# EAGLE design mini_shirasu (EAGLE 9.7.0)
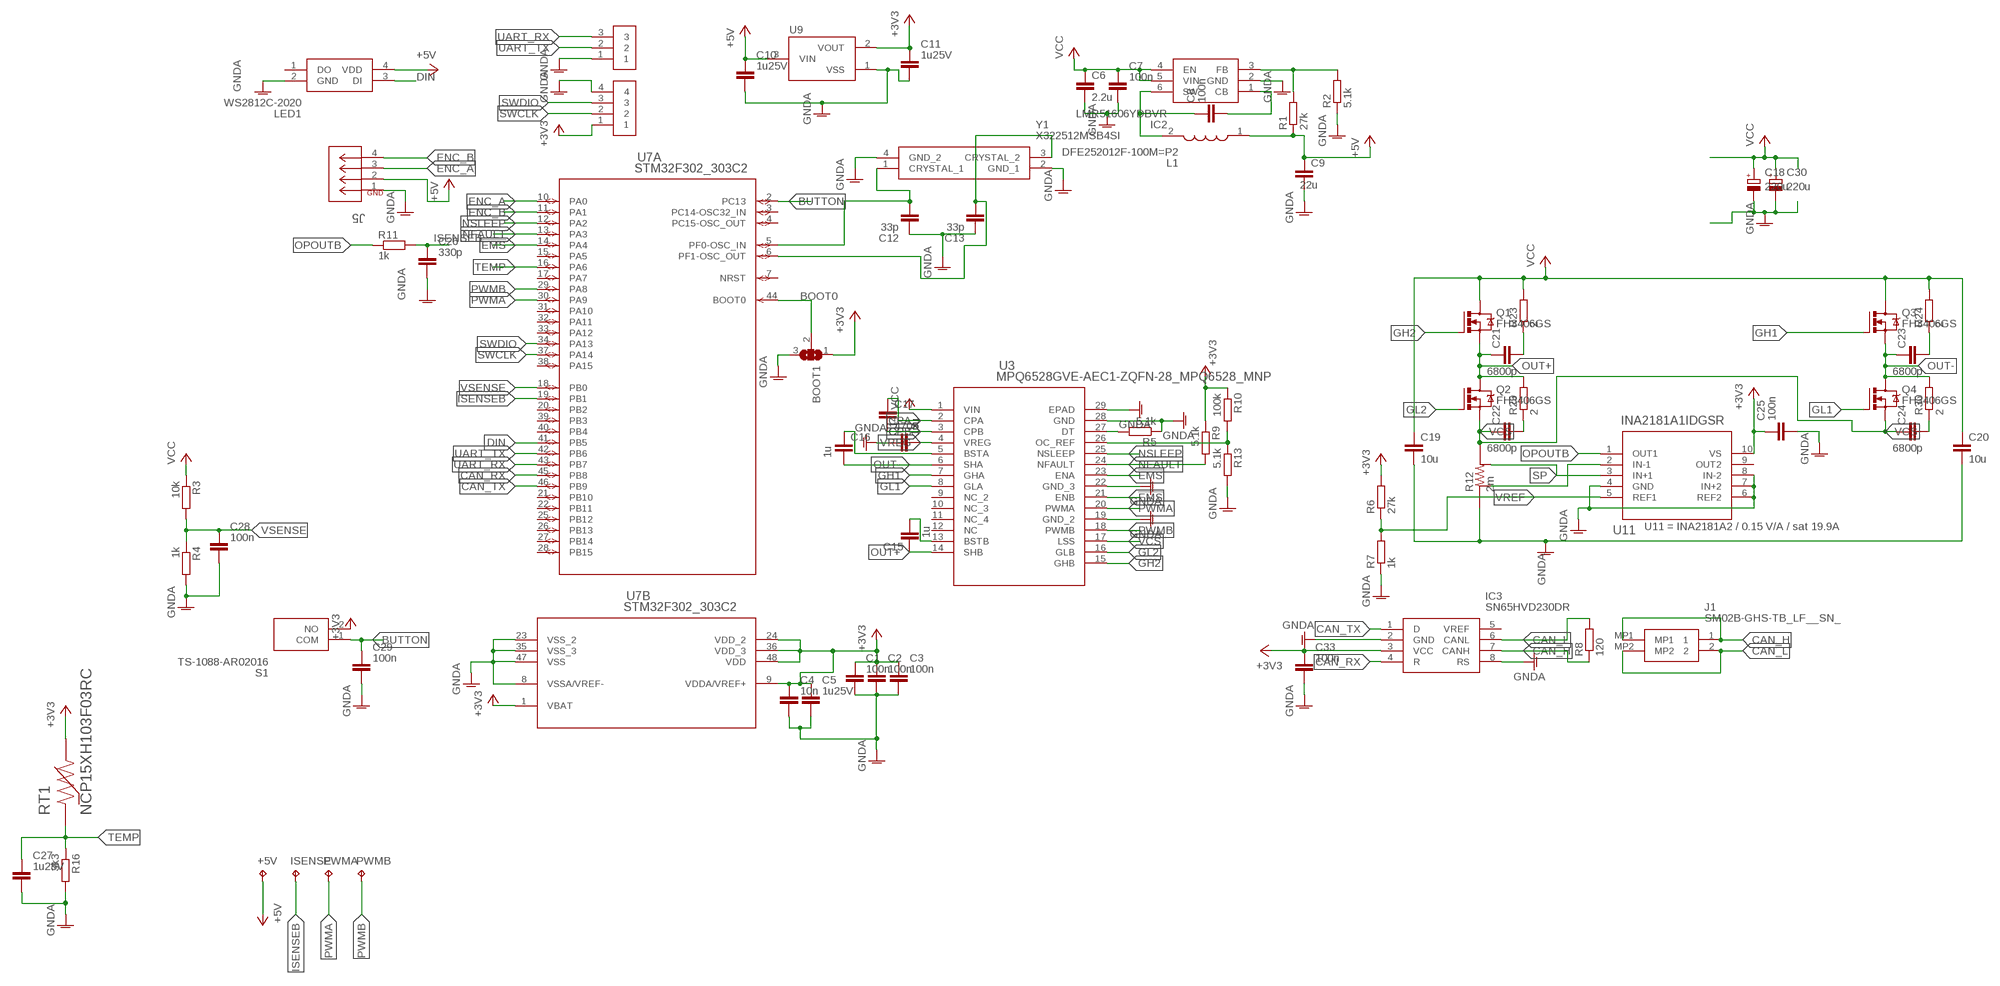
[diagram p0: schematic, sheet 1, part 1 of 2]
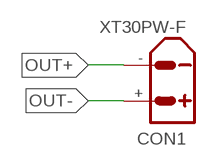
[diagram p1: schematic, sheet 1, part 2 of 2]

## Parts
+5V  TPB1,27  [B1,27]
BOOT1  SJ2W  [SJ_2]
C1  100n  C_CHIP-0402(1005-METRIC)  [CAPC1005X60]
C2  100n  C_CHIP-0402(1005-METRIC)  [CAPC1005X60]
C3  100n  C_CHIP-0402(1005-METRIC)  [CAPC1005X60]
C4  10n  C_CHIP-0402(1005-METRIC)  [CAPC1005X60]
C5  1u25V  C_CHIP-0402(1005-METRIC)  [CAPC1005X60]
C6  2.2u  C-EUC0805  [C0805]
C7  100n  C_CHIP-0402(1005-METRIC)  [CAPC1005X60]
C8  100n  C_CHIP-0402(1005-METRIC)  [CAPC1005X60]
C9  22u  C-EUC0805  [C0805]
C10  1u25V  C_CHIP-0402(1005-METRIC)  [CAPC1005X60]
C11  1u25V  C_CHIP-0402(1005-METRIC)  [CAPC1005X60]
C12  33p  C_CHIP-0402(1005-METRIC)  [CAPC1005X60]
C13  33p  C_CHIP-0402(1005-METRIC)  [CAPC1005X60]
C14  10u  C-EUC0805  [C0805]
C15  1u  C-EUC0603  [C0603]
C16  1u  C-EUC0603  [C0603]
C17  470n  C-EUC0805  [C0805]
C18  220u  C-POL_ECAP-10.5MM  [CAPAE1030X1050N]
C19  10u  C-EUC0805  [C0805]
C20  10u  C-EUC0805  [C0805]
C21  6800p  C-EUC0603  [C0603]
C22  6800p  C-EUC0603  [C0603]
C23  6800p  C-EUC0603  [C0603]
C24  6800p  C-EUC0603  [C0603]
C25  100n  C_CHIP-0402(1005-METRIC)  [CAPC1005X60]
C26  330p  C_CHIP-0402(1005-METRIC)  [CAPC1005X60]
C27  1u25V  C_CHIP-0402(1005-METRIC)  [CAPC1005X60]
C28  100n  C_CHIP-0402(1005-METRIC)  [CAPC1005X60]
C29  100n  C_CHIP-0402(1005-METRIC)  [CAPC1005X60]
C30  220u  C-POL_ECAP-10.5MM  [CAPAE1030X1050N]
C33  100n  C_CHIP-0402(1005-METRIC)  [CAPC1005X60]
CON1  XT30PW-F  [XT30PW-F]
IC2  LMR51606YDBVR  [SOT95P280X145-6N]
IC3  SN65HVD230DR  [SOT127P600X175-8N]
ISENSE  TPB1,27  [B1,27]
J1  SM02B-GHS-TB_LF__SN_  [SM02BGHSTBLFSN]
J5  EP2.5-4-SIDE  [CONN4_1744426-4]
L1  DFE252012F-100M=P2  [DFE2HCAH1R0MJ0L]
LED1  WS2812C-2020  [WS2812C2020]
PWMA  TPB1,27  [B1,27]
PWMB  TPB1,27  [B1,27]
Q1  FH3406GS  [DFN-8-5X6-FH3406GS]
Q2  FH3406GS  [DFN-8-5X6-FH3406GS]
Q3  FH3406GS  [DFN-8-5X6-FH3406GS]
Q4  FH3406GS  [DFN-8-5X6-FH3406GS]
R1  27k  R-EU_R0402  [R0402]
R2  5.1k  R-EU_R0402  [R0402]
R3  10k  R-EU_R0402  [R0402]
R4  1k  R-EU_R0402  [R0402]
R5  5.1k  R-EU_R0402  [R0402]
R6  27k  R-EU_R0402  [R0402]
R7  1k  R-EU_R0402  [R0402]
R8  120  R-EU_R0603  [R0603]
R9  5.1k  R-EU_R0402  [R0402]
R10  100k  R-EU_R0402  [R0402]
R11  1k  R-EU_R0402  [R0402]
R12  2m  R2512  [2512-4PAD]
R13  5.1k  R-EU_R0402  [R0402]
R16  3k3  R-EU_R0402  [R0402]
R23  2  R-EU_R0603  [R0603]
R24  2  R-EU_R0603  [R0603]
R29  2  R-EU_R0603  [R0603]
R30  2  R-EU_R0603  [R0603]
RT1  NCP15XH103F03RC  [THRMC1005X55N]
S1  TS-1088-AR02016  [TS1088AR02016]
U3  MPQ6528GVE-AEC1-ZQFN-28_MPQ6528_MNP  [QFN-28_MPQ6528_MNP]
U7  STM32F302_303C2  [LQFP48-7X7MM]
U9  XC6206  [SOT95P240X110-3]
U11  INA2181A1IDGSR  [DGS10]
U$1  PIN_HEADERPIN_HEADER  [PIN_HEADER]
U$2  3PIN_HEADER  [3PIN_HEADER]
Y1  X322512MSB4SI  [X322512MSB4SI]

## Nets
!EMS: U3.21(ENB) U3.23(ENA) U7.14(A:PA4)
+3V3: BOOT1.1 C1.1 C2.1 C3.1 C4.1 C5.1 C11.1 C25.1 C33.1 IC3.3(VCC) R6.2 R9.1 R10.1 RT1.2 S1.2(NO) U7.1(B:VBAT) U7.9(B:VDDA/VREF+) U7.24(B:VDD_2) U7.36(B:VDD_3) U7.48(B:VDD) U9.2(VOUT) U11.10(VS) U$1.1
+5V: +5V.TP C9.1 C10.1 J5.2 L1.1 LED1.4(VDD) R1.1 U9.3(VIN)
BOOT0: BOOT1.2 U7.44(A:BOOT0)
BST1: C16.1 U3.5(BSTA)
BST2: C15.2 U3.13(BSTB)
BUTTON: C29.1 S1.1(COM) U7.2(A:PC13)
CAN_H: IC3.7(CANH) J1.1 J1.MP1 R8.1
CAN_L: IC3.6(CANL) J1.2 J1.MP2 R8.2
CAN_RX: IC3.4(R) U7.45(A:PB8)
CAN_TX: IC3.1(D) U7.46(A:PB9)
CB: C8.2 IC2.1(CB)
CPA: C17.1 U3.2(CPA)
CPB: C17.2 U3.3(CPB)
DIN: LED1.3(DI) U7.41(A:PB5)
DT: R5.2 U3.27(DT)
ENC_A: J5.3 U7.10(A:PA0)
ENC_B: J5.4 U7.11(A:PA1)
FB: IC2.3(FB) R1.2 R2.2
GH1 [gate]: Q3.4(G) U3.7(GHA)
GH2 [gate]: Q1.4(G) U3.15(GHB)
GL1 [gate]: Q4.4(G) U3.8(GLA)
GL2 [gate]: Q2.4(G) U3.16(GLB)
GNDA: BOOT1.3 C1.2 C2.2 C3.2 C4.2 C5.2 C6.2 C7.2 C9.2 C10.2 C11.2 C12.1 C13.1 C14.1 C18.2(-) C19.2 C20.2 C25.2 C26.2 C27.2 C28.2 C29.2 C30.2(-) C33.2 IC2.2(GND) IC3.2(GND) IC3.8(RS) J5.1 LED1.2(GND) R2.1 R4.2 R5.1 R7.1 R12.1 R12.2 R13.2 R16.2 U3.19(GND_2) U3.22(GND_3) U3.28(GND) U3.29(EPAD) U7.8(B:VSSA/VREF-) U7.23(B:VSS_2) U7.35(B:VSS_3) U7.47(B:VSS) U9.1(VSS) U11.4(GND) U11.6(REF2) U11.7(IN+2) U11.8(IN-2) U$1.4 U$2.1 Y1.2(GND_1) Y1.4(GND_2)
ISENSEB: C26.1 ISENSE.TP R11.2 U7.19(A:PB1)
N$2: C12.2 U7.5(A:PF0-OSC_IN) Y1.1(CRYSTAL_1)
N$3: C13.2 U7.6(A:PF1-OSC_OUT) Y1.3(CRYSTAL_2)
N$12: C22.2 R29.1
N$13: C24.2 R30.1
N$31: R12.5 U11.2(IN-1)
N$38: C23.2 R24.1
N$39: C21.2 R23.1
NFAULT: R9.2 U3.24(NFAULT) U7.13(A:PA3)
NSLEEP: U3.25(NSLEEP) U7.12(A:PA2)
OC_REF: R10.2 R13.1 U3.26(OC_REF)
OPOUTB: R11.1 U11.1(OUT1)
OUT+: C15.1 C21.1 CON1.- Q1.1(S) Q1.2(S) Q1.3(S) Q2.5(D) Q2.6(D) Q2.7(D) Q2.8(D) Q2.9(D) R29.2 U3.14(SHB)
OUT-: C16.2 C23.1 CON1.+ Q3.1(S) Q3.2(S) Q3.3(S) Q4.5(D) Q4.6(D) Q4.7(D) Q4.8(D) Q4.9(D) R30.2 U3.6(SHA)
PWMA: PWMA.TP U3.20(PWMA) U7.30(A:PA9)
PWMB: PWMB.TP U3.18(PWMB) U7.29(A:PA8)
SP: R12.6 U11.3(IN+1)
SW: C8.1 IC2.6(SW) L1.2
SWCLK: U7.37(A:PA14) U$1.2
SWDIO: U7.34(A:PA13) U$1.3
TEMP: C27.1 R16.1 RT1.1 U7.16(A:PA6)
UART_RX: U7.43(A:PB7) U$2.3
UART_TX: U7.42(A:PB6) U$2.2
VCC: C6.1 C7.1 C18.1(+) C19.1 C20.1 C30.1(+) IC2.4(EN) IC2.5(VIN) Q1.5(D) Q1.6(D) Q1.7(D) Q1.8(D) Q1.9(D) Q3.5(D) Q3.6(D) Q3.7(D) Q3.8(D) Q3.9(D) R3.1 R23.2 R24.2 U3.1(VIN)
VCS: C22.1 C24.1 Q2.1(S) Q2.2(S) Q2.3(S) Q4.1(S) Q4.2(S) Q4.3(S) R12.3 R12.4 U3.17(LSS)
VREF: R6.1 R7.2 U11.5(REF1)
VREG: C14.2 U3.4(VREG)
VSENSE: C28.1 R3.2 R4.1 U7.18(A:PB0)
Unconnected: IC3.5(VREF) LED1.1(DO) U3.9(NC_2) U3.10(NC_3) U3.11(NC_4) U3.12(NC) U7.3(A:PC14-OSC32_IN) U7.4(A:PC15-OSC_OUT) U7.7(A:NRST) U7.15(A:PA5) U7.17(A:PA7) U7.20(A:PB2) U7.21(A:PB10) U7.22(A:PB11) U7.25(A:PB12) U7.26(A:PB13) U7.27(A:PB14) U7.28(A:PB15) U7.31(A:PA10) U7.32(A:PA11) U7.33(A:PA12) U7.38(A:PA15) U7.39(A:PB3) U7.40(A:PB4) U11.9(OUT2)

## Notes on the sheet
- U11 = INA2181A2 / 0.15 V/A / sat 19.9A

## Library data of the parts
+5V ISENSE PWMA PWMB = testpad:TP: Test pad
BOOT1 = jumper:SJ2W: SMD solder JUMPER
C1-C5 C7 C8 C10-C13 C25-C29 C33 = Capacitor:C: Capacitor - Generic; CATEGORY: Capacitor; PACKAGE_SIZE: 0402; PACKAGE_TYPE: SMD; SUBCATEGORY: Ceramic Capacitors; TYPE: MLCC
C6 C9 C14-C17 C19-C24 = rcl:C-EU: CAPACITOR, European symbol; SPICEPREFIX: C
C18 C30 = Capacitor:C-POL: Capacitor Polarised - Generic; CATEGORY: Capacitor; PACKAGE_SIZE: 10.5MM; PACKAGE_TYPE: SMD; SUBCATEGORY: Aluminum Electrolytic Capacitors; TYPE: Radial Can
CON1 = amass:XT30: AMASS XT30 connector Store in Japan AMASS XT30 connector <https://szc.jp/ams-xt30>
IC2 = LMR51606YDBVR:LMR51606YDBVR: Buck Switching Regulator IC Positive Adjustable 0.8V 1 Output 600mA SOT-23-6 Source: Datasheet <https://www.ti.com/lit/ds/symlink/lmr51606.pdf?ts=1713788939340&ref_url=https%3A%2F%2Feu.mouser.com%2F>; ARROW_PART_NUMBER: LMR51606YDBVR; ARROW_PRICE-STOCK: https://www.arrow.com/en/products/lmr51606ydbvr/texas-instruments.html?utm_currency=USD&region=nac; DESCRIPTION: Buck Switching Regulator IC Positive Adjustable 0.8V 1 Output 600mA SOT-23-6; HEIGHT: 1.45mm; MANUFACTURER_NAME: Texas Instruments; MANUFACTURER_PART_NUMBER: LMR51606YDBVR; MOUSER_PART_NUMBER: 595-LMR51606YDBVR; MOUSER_PRICE-STOCK: https://www.mouser.co.uk/ProductDetail/Texas-Instruments/LMR51606YDBVR?qs=mELouGlnn3dthntO7hU%252BdA%3D%3D
IC3 = SN65HVD230DR:SN65HVD230DR: 3.3 V CAN Transceiver with Standby Mode Source: Datasheet <http://www.ti.com/lit/gpn/sn65hvd230>; ARROW_PART_NUMBER: SN65HVD230DR; ARROW_PRICE-STOCK: https://www.arrow.com/en/products/sn65hvd230dr/texas-instruments.html?utm_currency=USD&region=nac; DESCRIPTION: 3.3 V CAN Transceiver with Standby Mode; HEIGHT: 1.75mm; MANUFACTURER_NAME: Texas Instruments; MANUFACTURER_PART_NUMBER: SN65HVD230DR; MOUSER_PART_NUMBER: 595-SN65HVD230DR; MOUSER_PRICE-STOCK: https://www.mouser.co.uk/ProductDetail/Texas-Instruments/SN65HVD230DR?qs=QViXGNcIEAtifeQR3pYVUQ%3D%3D
J1 = SM02B-GHS-TB_v2:SM02B-GHS-TB_LF__SN_: JST GH 2-pin side-entry SMT connector. Datasheet: https://www.jst-mfg.com/product/pdf/eng/eGH.pdf; HEIGHT: 4.25mm; MANUFACTURER: JST; MPN: SM02B-GHS-TB(LF)(SN)
J5 = con-ep2.5:EP2.5-4-SIDE; MANUFACTURER_PART_NUMBER: 17444264; VENDOR: TE Connectivity
L1 = DFE252012F-100M=P2:DFE252012F-100M=P2: DFE252012F Series Inductor 10uH +/-20% 1008 (2520) Source: Datasheet <https://search.murata.co.jp/Ceramy/image/img/P02/J(E)TE243A-0017.pdf>; ARROW_PART_NUMBER: DFE252012F-100M=P2; ARROW_PRICE-STOCK: https://www.arrow.com/en/products/dfe252012f-100mp2/murata-manufacturing.html?utm_currency=USD&region=nac; DESCRIPTION: DFE252012F Series Inductor 10uH +/-20% 1008 (2520); HEIGHT: 1.2mm; MANUFACTURER_NAME: Murata Electronics; MANUFACTURER_PART_NUMBER: DFE252012F-100M=P2; MOUSER_PART_NUMBER: 81-DFE252012F-100MP2; MOUSER_PRICE-STOCK: https://www.mouser.co.uk/ProductDetail/Murata-Electronics/DFE252012F-100M%3dP2?qs=ty6qhqyUUEuRek9wjqhclw%3D%3D
LED1 = WS2812C-2020:WS2812C-2020: Intelligent control LED integrated light source Source: Datasheet <http://www.world-semi.com/DownLoadFile/139>; DESCRIPTION: Intelligent control LED integrated light source; HEIGHT: 0.84mm; MANUFACTURER_NAME: Worldsemi; MANUFACTURER_PART_NUMBER: WS2812C-2020
Q1-Q4 = FH3406GS_PDFN5x6_8L:FH3406GS
R1-R11 R13 R16 R23 R24 R29 R30 = rcl:R-EU_: RESISTOR, European symbol; SPICEPREFIX: R
R12 = shunt-resistor:R2512
RT1 = NCP15XH103F03RC:NCP15XH103F03RC: NTC Thermistor 10k 0402 (1005 Metric) Check prices <https://pricing.snapeda.com/parts/NCP15XH103F03RC/Murata/view-part?ref=eda>; AVAILABILITY: Good; DESCRIPTION: NTC Thermistor 10k 0402 (1005 Metric); MF: Murata; MP: NCP15XH103F03RC; PACKAGE: 1005 Taiyo Yuden; PRICE: None; PURCHASE-URL: https://pricing.snapeda.com/search/part/NCP15XH103F03RC/?ref=eda
S1 = TS-1088-AR02016:TS-1088-AR02016: Tact Switch Source: Datasheet <https://www.xunpudianzi.com/uploads/pdf/TS-1088-ARXXX.pdf>; DESCRIPTION: Tact Switch; HEIGHT: 2mm; MANUFACTURER_NAME: XUNPU; MANUFACTURER_PART_NUMBER: TS-1088-AR02016
U3 = MPQ6528GVE-AEC1-Z:MPQ6528GVE-AEC1-Z; COPYRIGHT: Copyright (C) 2026 Ultra Librarian. All rights reserved.; DATASHEET: https://www.monolithicpower.com/en/documentview/productdocument/index/version/2/document_type/Datasheet/lang/en/sku/MPQ6528GVE-AEC1; DESCRIPTION: 5V to 60V H-Bridge Gate Driver AEC-Q100 Qualified; MANUFACTURER_NAME: Monolithic Power Systems; MANUFACTURER_PART_NUMBER: MPQ6528GVE-AEC1-Z
U7 = stm32_mcu:STM32F302_303C2; COPYRIGHT: Copyright (C) 2016 Accelerated Designs. All rights reserved; MANUFACTURER_PART_NUMBER: STM32F302_303C2; VENDOR: STMicroelectronics
U9 = torex:XC6206
U11 = texas-instruments:INA2181A1IDGSR; BUILT_BY: EMA_Jessica; COPYRIGHT: Copyright (C) 2018 Accelerated Designs. All rights reserved; MANUFACTURER_PART_NUMBER: INA2181A2IDGSR; VENDOR: Texas Instruments
U$1 = CRS_EAGLE_Lib:PIN_HEADER
U$2 = CRS_EAGLE_Lib:3PIN_HEADER
Y1 = X322512MSB4SI:X322512MSB4SI: SMD Crystal Resonators 12MHz +/-10ppm SMD-3225_4P RoHS Source: Datasheet <https://datasheet.lcsc.com/szlcsc/Yangxing-Tech-X322512MSB4SI_C9002.pdf>; DESCRIPTION: SMD Crystal Resonators 12MHz +/-10ppm SMD-3225_4P RoHS; HEIGHT: 0.8mm; MANUFACTURER_NAME: Yangxing Tech; MANUFACTURER_PART_NUMBER: X322512MSB4SI

## Board
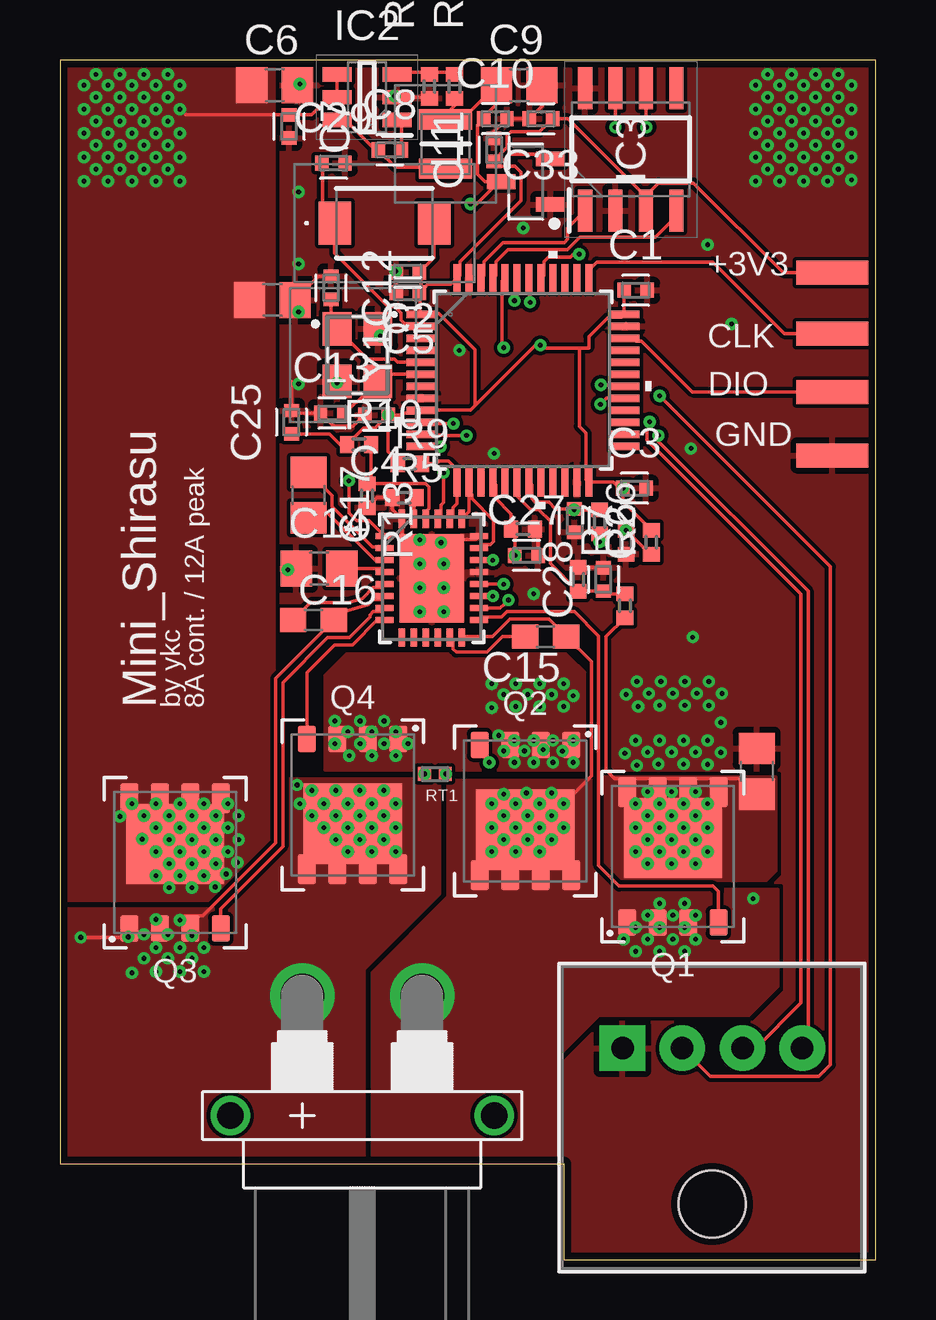
[diagram p2: board, top side]
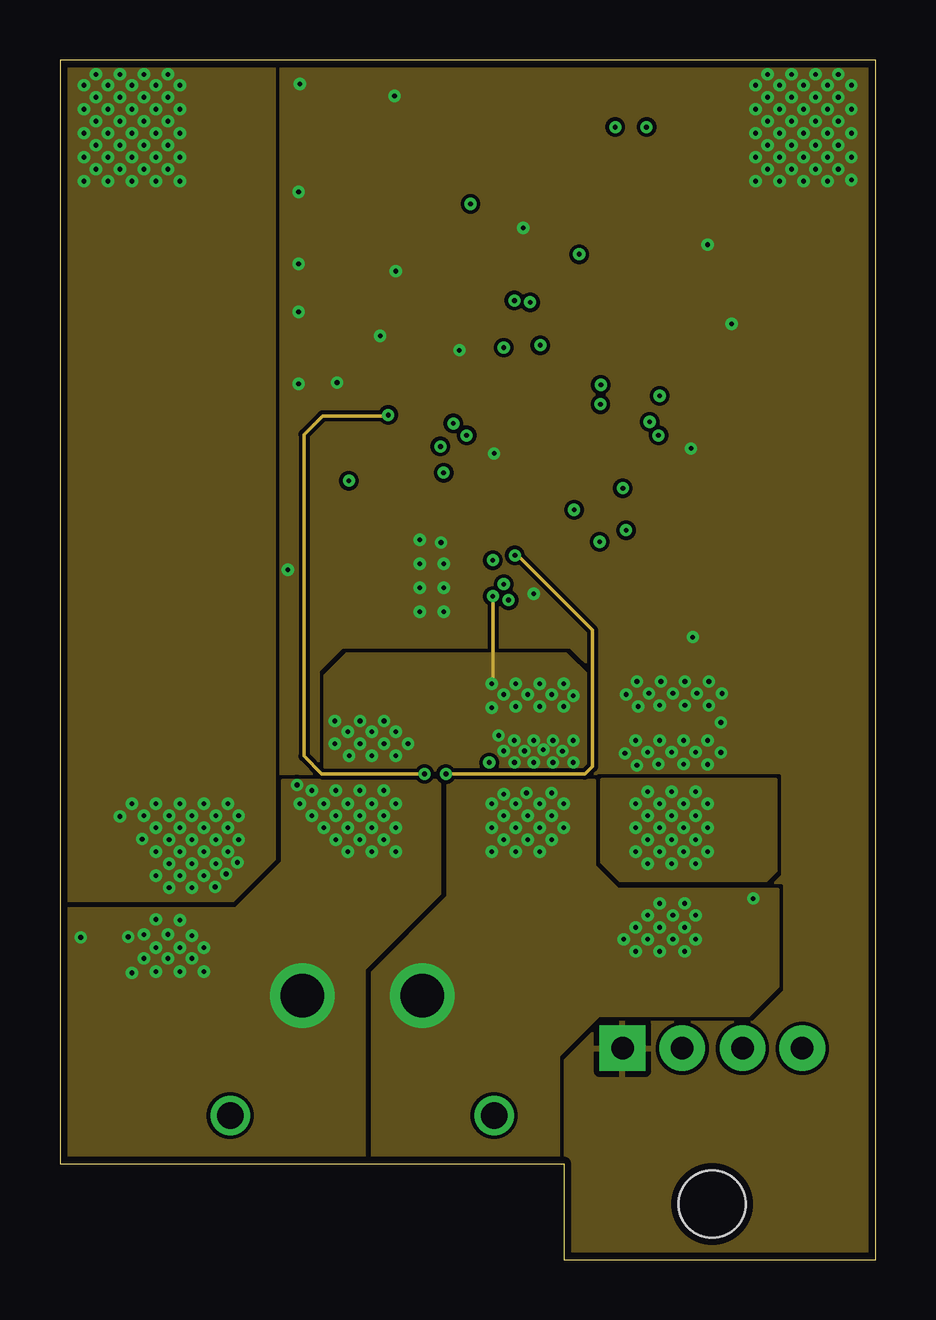
[diagram p3: board, inner layer Route2]
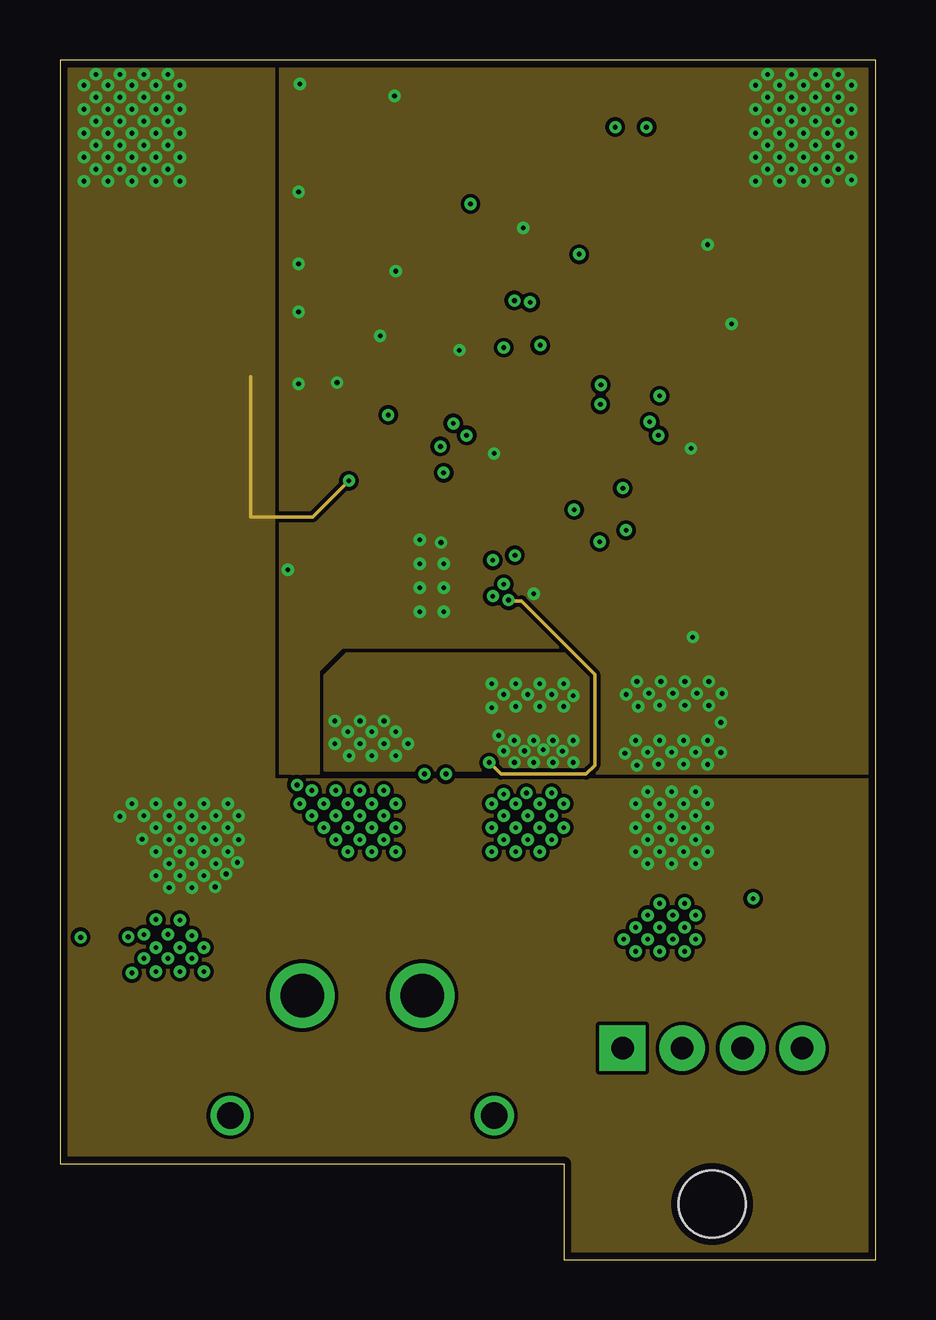
[diagram p4: board, inner layer Route15]
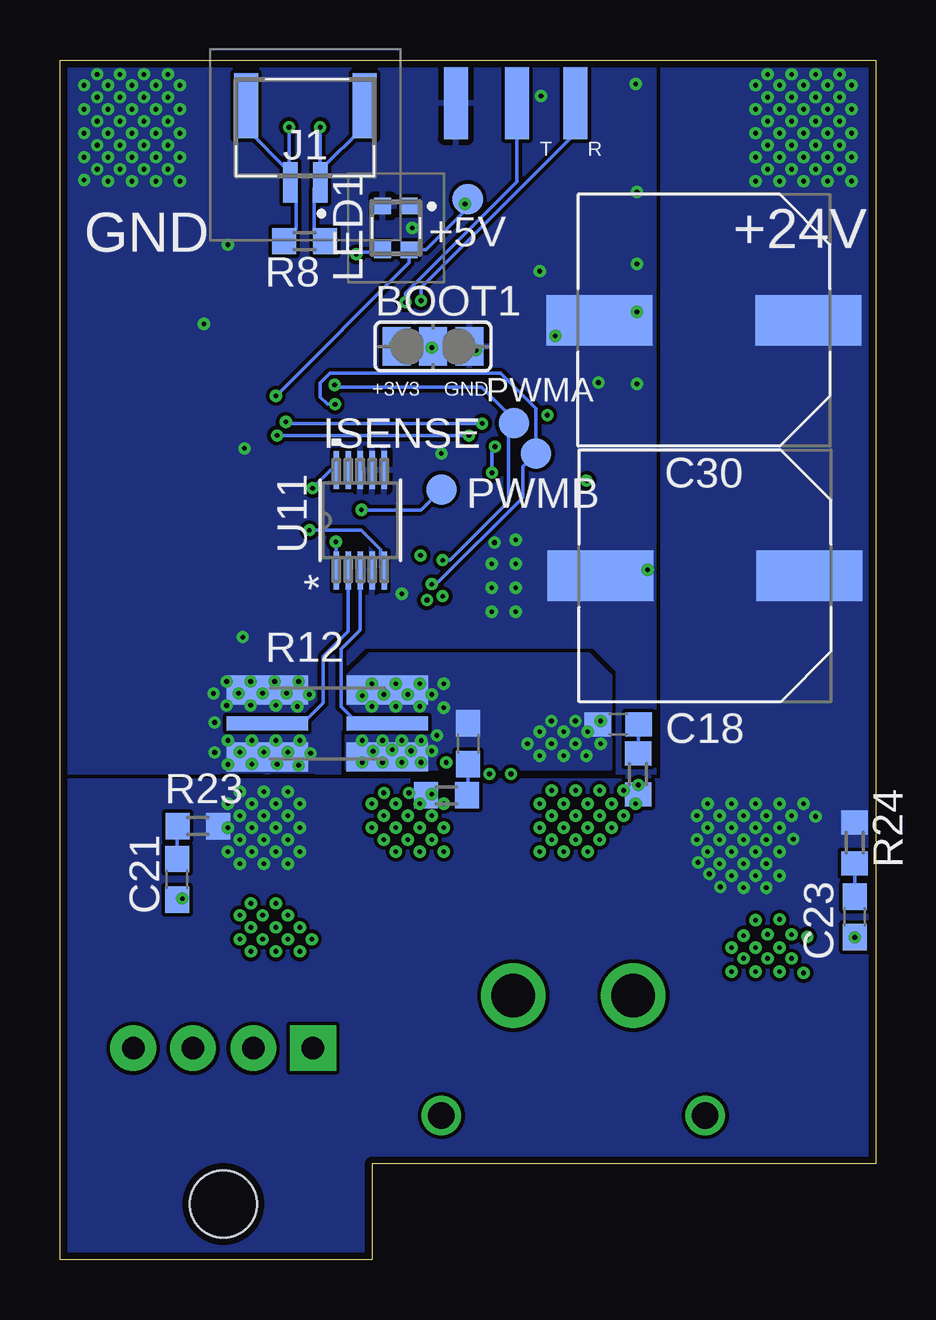
[diagram p5: board, bottom side, seen from below]

Size 34 x 50 mm. Coordinates in mm from the lower left corner, seen from the top.
Outline: 0,4 21,4 21,0 34,0 34,50 0,50 0,4
Copper layers (1+2*15+16): Top 0.035mm / dielectric 1.5mm / Route2 0.0175mm / dielectric 1.1mm / Route15 0.0175mm / dielectric 0.2mm / Bottom 0.035mm
Design rules "SeeedStudio_2layer_DRU_no_angle_20140221 *": minimum track width 6mil, minimum drill 0.2mm, track to track 6mil, track to pad 6mil, pad to pad 6mil, via to via 6mil, smd to smd 0mil, copper to edge 0.3mm, drill to drill 0.3mm, minimum pad ring 10mil, minimum via ring 6mil, stop-mask expansion 2mil, vias tented up to drill 100mil, thermal gap 10mil

### Footprints (pad centres in the part's own frame; a part is rotated, then mirrored left to right if it is on the bottom)
B1,27 = smd 1.27 x 1.27: TP 0,0
SJ_2 = smd 1.168 x 1.6: 1 -1.524,0; 2 0,0; 3 1.524,0
CAPC1005X60 = smd 0.56 x 0.629: 1 -0.485,0; 2 0.485,0
C0805 = smd 1.3 x 1.5: 1 -0.95,0; 2 0.95,0
C0603 = smd 1.1 x 1: 1 -0.85,0; 2 0.85,0
CAPAE1030X1050N = smd 4.416 x 2.115: 1 -4.353,0; 2 4.353,0
XT30PW-F = drill 1.8: + 2.5,0; - -2.5,0 | drill 1.1: P$3 -5.5,5; P$4 5.5,5
SOT95P280X145-6N = smd 1.2 x 0.6: 1 -1.25,0.95; 2 -1.25,0; 3 -1.25,-0.95; 4 1.25,-0.95; 5 1.25,0; 6 1.25,0.95
SOT127P600X175-8N = smd 1.75 x 0.6: 1 -2.55,1.905; 2 -2.55,0.635; 3 -2.55,-0.635; 4 -2.55,-1.905; 5 2.55,-1.905; 6 2.55,-0.635; 7 2.55,0.635; 8 2.55,1.905
SM02BGHSTBLFSN = smd 0.6 x 1.7: 1 -1.85,4.3; 2 -0.6,4.3 | smd 1 x 2.7: MP1 -3.7,1.1; MP2 1.25,1.1
CONN4_1744426-4 = drill 0.94 pad 1.905 square: 1 7.493,0 | drill 0.94 pad 1.905: 2 5.004,0; 3 2.489,0; 4 0,0 | hole 2.794: 3.759,6.502
DFE2HCAH1R0MJ0L = smd 0.85 x 2.2: 1 -1.025,0; 2 1.025,0
WS2812C2020 = smd 0.7 x 0.7: 1 0.915,-0.55; 2 0.915,0.55; 3 -0.915,0.55; 4 -0.915,-0.55
DFN-8-5X6-FH3406GS = smd 0.75 x 1.1: 1 1.905,2.75; 2 0.635,2.75; 3 -0.635,2.75; 4 -1.905,2.75 | smd 0.75 x 1.25: 5 -1.905,-2.675; 6 -0.635,-2.675; 7 0.635,-2.675; 8 1.905,-2.675 | smd 4.1 x 3.35: 9 0,-0.775
R0402 = smd 0.6 x 0.7: 1 -0.5,0; 2 0.5,0
R0603 = smd 1 x 1.1: 1 -0.85,0; 2 0.85,0
2512-4PAD = smd 3.4 x 1.2: 1 -2.5,1.4; 2 -2.5,-1.4; 3 2.5,1.4; 4 2.5,-1.4 | smd 3.4 x 0.6: 5 -2.5,0; 6 2.5,0
THRMC1005X55N = smd 0.54 x 0.6: 1 -0.432,0; 2 0.432,0
TS1088AR02016 = smd 1.35 x 1.8: 1 -2.075,0; 2 2.075,0
QFN-28_MPQ6528_MNP = smd 0.757 x 0.255: 1 -1.966,1.75; 2 -1.966,1.25; 3 -1.966,0.75; 4 -1.966,0.25; 5 -1.966,-0.25; 6 -1.966,-0.75; 7 -1.966,-1.25; 8 -1.966,-1.75; 15 1.966,-1.75; 16 1.966,-1.25; 17 1.966,-0.75; 18 1.966,-0.25; 19 1.966,0.25; 20 1.966,0.75; 21 1.966,1.25; 22 1.966,1.75 | smd 0.255 x 0.757: 9 -1.25,-2.474; 10 -0.75,-2.474; 11 -0.25,-2.474; 12 0.25,-2.474; 13 0.75,-2.474; 14 1.25,-2.474; 23 1.25,2.474; 24 0.75,2.474; 25 0.25,2.474; 26 -0.25,2.474; 27 -0.75,2.474; 28 -1.25,2.474 | smd 2.7 x 3.7: 29 0,0
LQFP48-7X7MM = smd 1.194 x 0.305: 1 -4.25,2.75; 2 -4.25,2.25; 3 -4.25,1.75; 4 -4.25,1.25; 5 -4.25,0.75; 6 -4.25,0.25; 7 -4.25,-0.25; 8 -4.25,-0.75; 9 -4.25,-1.25; 10 -4.25,-1.75; 11 -4.25,-2.25; 12 -4.25,-2.75; 25 4.25,-2.75; 26 4.25,-2.25; 27 4.25,-1.75; 28 4.25,-1.25; 29 4.25,-0.75; 30 4.25,-0.25; 31 4.25,0.25; 32 4.25,0.75; 33 4.25,1.25; 34 4.25,1.75; 35 4.25,2.25; 36 4.25,2.75 | smd 0.305 x 1.194: 13 -2.75,-4.25; 14 -2.25,-4.25; 15 -1.75,-4.25; 16 -1.25,-4.25; 17 -0.75,-4.25; 18 -0.25,-4.25; 19 0.25,-4.25; 20 0.75,-4.25; 21 1.25,-4.25; 22 1.75,-4.25; 23 2.25,-4.25; 24 2.75,-4.25; 37 2.75,4.25; 38 2.25,4.25; 39 1.75,4.25; 40 1.25,4.25; 41 0.75,4.25; 42 0.25,4.25; 43 -0.25,4.25; 44 -0.75,4.25; 45 -1.25,4.25; 46 -1.75,4.25; 47 -2.25,4.25; 48 -2.75,4.25
SOT95P240X110-3 = smd 1.18 x 0.609: 1 -1.024,0.95; 2 -1.024,-0.95; 3 1.024,0
DGS10 = smd 1.575 x 0.229: 1 -2.095,1; 2 -2.095,0.5; 3 -2.095,0; 4 -2.095,-0.5; 5 -2.095,-1; 6 2.095,-1; 7 2.095,-0.5; 8 2.095,0; 9 2.095,0.5; 10 2.095,1
PIN_HEADER = smd 3 x 1: 1 0,5.08; 2 0,2.54; 3 0,0.1; 4 0,-2.54
3PIN_HEADER = smd 3 x 1: 1 0,2.54; 2 0,0; 3 0,-2.44
X322512MSB4SI = smd 1.4 x 1.2: 1 -1.1,-0.85; 2 1.1,-0.85; 3 1.1,0.85; 4 -1.1,0.85

### Placement (x,y rotation side)
+5V  17,44.2 0 bottom
BOOT1  18.45,38.06 0 bottom
C1  24,40.4 0 top
C2  14.5,41.15 180 top
C3  23.95,32.15 0 top
C4  13.2,35.2 180 top
C5  14.5,40.3 180 top
C6  8.95,48.95 0 top
C7  9.55,47.23 270 top
C8  13.75,46.25 0 top
C9  19.15,48.95 0 top
C10  18.15,47.55 0 top
C11  18.1,46.25 90 top
C12  11.3,40.5 270 top
C13  11.35,35.28 0 top
C14  10.8,28.8 0 top
C15  20.25,25.97 180 top
C16  10.57,26.65 0 top
C17  10.37,31.86 270 top
C18  7.11,28.5 180 bottom
C19  8.85,40 0 top
C20  29.05,20.35 90 top
C21  29.11,15.85 90 bottom
C22  16.99,21.5 270 bottom
C23  0.86,14.28 90 bottom
C24  10.73,22.31 0 bottom
C25  9.65,34.9 90 top
C26  21.45,30.8 270 top
C27  19.45,29.35 0 top
C28  22.65,28.35 90 top
C29  11.4,45.7 0 top
C30  7.15,39.15 180 bottom
C33  20.05,47.55 180 top
CON1  12.6,11 180 top
IC2  12.8,48.45 180 top
IC3  23.79,46.27 90 top
ISENSE  18.1,32.1 180 bottom
J1  25,49.2 180 bottom
J5  30.94,8.81 180 top
L1  16.08,46.49 270 top
LED1  20,43 90 bottom
PWMA  15.07,34.86 180 bottom
PWMB  14.15,33.6 180 bottom
Q1  25.55,16.8 180 top
Q2  19.4,18.7 0 top
Q3  4.8,16.55 180 top
Q4  12.2,18.95 0 top
R1  16.45,48.9 90 top
R2  15.4,48.9 90 top
R3  23.55,27.25 90 top
R4  21.6,28.35 90 top
R5  14.35,31.76 0 top
R6  24.65,29.9 90 top
R7  23.6,29.9 90 top
R8  23.8,42.45 180 bottom
R9  14.58,33.17 0 top
R10  12.47,33.97 0 top
R11  22.5,30.75 90 top
R12  22.85,22.35 0 bottom
R13  12.8,31.83 270 top
R16  19.3,30.45 0 top
R23  28.25,18.07 0 bottom
R24  0.87,17.37 90 bottom
R29  17.89,19.35 180 bottom
R30  9.9,20.24 270 bottom
RT1  15.63,20.24 180 top
S1  13.53,43.2 0 top
U3  15.5,28.4 0 top
U7  19.3,36.65 0 top
U9  19.42,44.93 180 top
U11  21.48,30.81 90 bottom
U$1  32.2,36.06 0 top
U$2  14.95,48.2 90 bottom
Y1  12.4,37.7 270 top

### Tracks (layer width: path | path; a pad name or v marks a point on that pad's centre or on a via)
!EMS
  Top 0.152: U3.23 17.05,31.17 17.05,32 | 17.05,32 U7.14 | 17.05,32 17.17,31.88 17.17,31.71 18.07,30.8 18.07,29.93 17.94,29.79 17.61,29.79 U3.21
+3V3  (via drill 0.2)
  Top 0.152: 21.65,38 22.05,38 22.05,38.47 22.86,39.28 23.43,39.28 U7.36 23.52,39.44 C1.1 | 21.65,38 20.13,38 v20.02,38.11 19.82,38.11 17.31,35.59 | 17.31,35.59 17.11,35.4 U7.9 14.93,35.28 14.36,35.28 14.28,35.2 C4.1 | 24.43,44.17 24.43,44.3 21.18,47.55 C33.1 19.99,47.01 18.81,47.01 18.64,46.84 18.64,46.36 18.1,45.82 C11.1 | 17.31,35.59 17.31,37.92 15.8,39.43 15.08,39.43 U7.1 15,39.45 15,40.3 C5.1 | 24.43,44.17 24.53,44.27 24.53,44.45 24.95,44.88 26.41,44.88 30.15,41.14 U$1.1 | S1.2 15.6,41.77 C2.1 15.05,41.15 15.05,40.37 C5.1 | C5.1 15.34,40.65 16.3,40.65 U7.48 16.67,41.02 16.67,41.59 19.21,44.13 19.21,45.33 18.98,45.56 18.3,45.56 C11.1 | C11.1 18.12,45.78 18.47,45.78 18.76,46.08 20.24,46.08 U9.2 | IC3.3 24.43,44.17 | C4.1 13.14,34.66 12.66,34.66 R10.1 11.68,33.97 11.23,34.41 C25.1 | C4.1 13.69,33.69 13.8,33.57 13.8,33.45 R9.1 | R6.2 23.46,31.59 23.46,32 | 23.46,32 C3.1 | 23.46,32 23.07,32.4 U7.24 21.93,32.52 21.93,34.44 21.65,34.72 21.65,38
  Route2 0.152: RT1.2 10.91,20.24 10.17,20.98 10.17,34.39 10.94,35.16 13.65,35.16 C4.1
  Bottom 0.152: C3.1 22.71,32.91 U11.10
  other vias: 15.2,20.24 23.47,32.15 13.68,35.2
+5V  (via drill 0.2)
  Top 0.152: J5.2 27.12,7.63 31.63,7.63 32.12,8.12 32.12,28.88 v25,36 | 18.3,44.93 17.72,44.93 17.41,45.24 17.41,47.29 C10.1 17.66,47.62 18.2,48.15 C9.1 18.13,48.88 17.98,48.88 17.98,48.73 16.87,47.62 16.18,47.62 L1.1 16.08,47.72 16.45,48.09 R1.1 | 18.3,44.93 U9.3 | v17.12,44 17.37,44 18.3,44.93
  Bottom 0.152: v25,36 19.45,41.55 LED1.4 18.75,42.09 17.09,43.74 17.09,44.1 +5V.TP 17.12,44.08 v17.12,44
BOOT0  (via drill 0.2)
  Top 0.152: U7.44 18.43,40.78 18.43,38.08 v18.5,38.01
BST1
  Top 0.152: U3.5 13.39,28.01 13.06,28.01 12.61,27.55 12.03,27.38 10.45,27.38 C16.1
BST2
  Top 0.152: U3.13 16.39,25.78 16.39,25.45 16.53,25.32 17.8,25.32 18.45,25.97 C15.2
BUTTON
  Top 0.152: U7.2 14.93,39.02 14.36,39.02 14.22,39.15 14.22,39.45 13.95,39.73 13.67,39.73 11.45,41.94 S1.1 10.95,43.7 10.95,45.66 C29.1
CAN_H  (via drill 0.2)
  Top 0.152: v23.15,47.2 v23.16,47.21 IC3.7
  Bottom 0.152: v23.15,47.2 J1.1 | J1.1 23.15,45.4 21.3,47.25 J1.MP1 | J1.1 23.4,44.65 23.4,42.9 R8.1
CAN_L  (via drill 0.2)
  Top 0.152: v24.45,47.2 24.43,47.22 IC3.6
  Bottom 0.152: J1.2 24.4,45.3 26.25,47.15 J1.MP2 | v24.45,47.2 24.45,44.95 J1.2 | J1.2 24.15,44.65 24.15,42.95 R8.2
CAN_RX
  Top 0.152: U7.45 18.17,41.02 18.17,41.59 18.67,42.09 21.15,42.09 21.68,42.62 24.82,42.62 25.7,43.5 IC3.4
CAN_TX
  Top 0.152: U7.46 17.67,41.02 17.67,41.59 18.47,42.4 21.03,42.4 21.16,42.53 21.16,43 IC3.1
CB
  Top 0.152: IC2.1 14.23,47.31 C8.2
CPA
  Top 0.152: U3.2 13.49,29.69 13.04,29.69 11.35,31.38 11.35,31.84 C17.1
CPB
  Top 0.152: U3.3 13.13,29.15 10.87,31.41 C17.2
DIN  (via drill 0.2)
  Top 0.152: U7.41 20.17,41.02 20.17,41.59 20.36,41.79 21.28,41.79 21.4,41.9 v21.65,41.9
  Bottom 0.152: LED1.3 20.64,42 21.55,42 v21.65,41.9
DT
  Top 0.152: U3.27 14.75,31.65 R5.2
ENC_A  (via drill 0.2)
  Top 0.152: v16.4,34.85 15.1,34.85 U7.10 | v24.59,34.91 24.59,34.67 24.47,34.55 24.47,34.15 30.89,27.73 30.89,10.69 29,8.81 J5.3
  Bottom 0.152: v16.4,34.85 24.52,34.85 v24.59,34.91
ENC_B  (via drill 0.2)
  Top 0.152: v24.95,34.35 25,34.35 24.85,34.2 31.19,27.86 31.19,9.06 J5.4 | v16.95,34.35 16.08,34.35 16.06,34.37 15.08,34.37 U7.11
  Bottom 0.152: v24.95,34.35 v16.95,34.35
FB
  Top 0.152: 15.4,49.5 R2.2 | 15.4,49.5 16.36,49.5 R1.2 | IC2.3 14.15,49.5 15.4,49.5
GH1
  Top 0.152: U3.7 13.39,27.01 13.06,27.01 12.93,26.87 12.93,26.78 12.06,25.92 11.16,25.92 9.3,24.06 9.3,17.22 6.69,14.61 6.69,13.81 Q3.4
GH2
  Top 0.152: U3.15 17.6,26.78 18.41,26.78 18.63,27 21.44,27 22.45,25.99 22.45,16.42 23.3,15.57 27.23,15.57 27.45,15.35 Q1.4
GL1
  Top 0.152: U3.8 13.22,26.65 12.19,25.62 11.45,25.62 10.29,24.46 Q4.4
GL2  (via drill 0.2)
  Top 0.152: U3.16 18.34,27.15 18.5,27.31 18.52,27.31 v18.7,27.49 | v17.9,20.71 17.49,21.12 Q2.4
  Route15 0.152: v17.9,20.71 18.38,20.23 21.93,20.23 22.3,20.6 22.3,24.39 19.24,27.45 18.74,27.45 v18.7,27.49
GNDA  (via drill 0.2)
  Top 0.152: C11.2 18.1,47.01 C10.2 C33.2 20.09,48.08 C9.2 | C19.2 10.79,40.98 C12.1 | C2.2 C5.2 | R2.1 15.35,48.45 IC2.2 | C28.2 21.61,28.84 R4.2 | U3.22 17.32,30.01 16.01,30.01 v15.89,29.89 | R16.2 19.93,30.32 C27.2 | 9.65,36.6 C25.2 9.75,35.28 C13.1 11.38,34.77 11.43,34.77 11.46,34.74 12.21,34.74 12.67,35.2 C4.2 | R13.2 13.22,31.75 R5.1 13.85,31.27 U3.28 14.25,29.65 U3.29
  other vias: 32,47.95 32,48.95 31,48.95 31,47.95 30,47.95 30,48.95 29,48.95 29,47.95 29,46.95 30,46.95 31,46.95 32,46.95 28,39 16.65,37.9 13.35,38.5 10,49 13.95,48.5 27,42.3 26.31,33.81 29,45.95 30,45.95 31,45.95 32,45.95 29,44.95 30,44.95 31,44.95 32,44.95 24,21.64 25,21.64 26,21.64 27,21.64 26,20.65 24.05,20.6 24.95,20.65 26.5,21.15 18.1,33.6 29.5,48.45 30.5,48.45 31.5,48.45 31.5,47.45 30.5,47.45 29.5,47.45 29.5,46.45 30.5,46.45 31.5,46.45 31.5,45.45 30.5,45.45 29.5,45.45 31.5,49.4 30.5,49.4 29.5,49.4 24.5,21.15 25.5,21.15 23.55,21.1 27,20.64 27.55,21.14 27.55,22.39 14,41.2 19.31,43 26.38,25.94 11.55,36.55 24.05,24.09 25.05,24.09 26.05,24.09 27.05,24.09 26.05,23.1 25,23.1 26.55,23.6 24.55,23.6 25.55,23.6 27.05,23.09 27.6,23.59 24.1,23.05 23.6,23.55 19.75,27.75 9.5,28.75 16,27 15,27 15,28 16,28 16,29 15,29 15,30 33,45 32.45,45.45 33,45.95 32.45,46.45 33,46.95 32.45,47.45 33,47.95 32.45,48.45 33,48.95 32.45,49.4 9.95,44.5 9.95,41.5 9.95,36.5 9.95,39.5
  pour Top (rank 2): 0,0 34,0 34,50 0,50
  pour Bottom (rank 2): 0,0 34,0 34,50 0,50
  pour Route2 (rank 2): 0,0 34,0 34,50 0,50
  pour Route15 (rank 2): 0,0 34,0 34,50 0,50
  pour Bottom (no thermals): 23.08,20.33 27.92,20.33 27.92,25.92 23.08,25.92
  pour Bottom (no thermals): 9.23,27.08 13.92,27.08 13.92,42.92 9.23,42.92
  pour Bottom (no thermals): 11.28,37.58 14.92,37.58 14.92,41.62 11.28,41.62
  pour Bottom (no thermals): 9.28,37.73 13.62,37.73 13.92,38.03 13.92,40.37 13.77,40.52 9.28,40.52 9.28,37.73
ISENSEB  (via drill 0.2)
  Top 0.152: 21.4,31.29 20.66,31.29 20.38,31.57 19.8,31.57 19.67,31.71 19.67,32.28 U7.19 | 21.4,31.29 C26.1 21.45,31.27 v21.43,31.25 | R11.2 v21.43,31.25 | v21.43,31.25 21.4,31.29
  Bottom 0.152: v21.43,31.25 18.95,31.25 ISENSE.TP
N$2
  Top 0.152: C12.2 11.3,39.05 Y1.1 12.82,37.53 13.95,37.53 14.07,37.4 U7.5
N$3
  Top 0.152: U7.6 13.55,36.9 Y1.3 12.39,35.74 12.34,35.74 11.88,35.28 C13.2
N$12
  Bottom 0.152: R29.1 16.99,19.4 C22.2
N$13
  Bottom 0.152: C24.2 9.88,21.11 R30.1
N$31
  Bottom 0.152: U11.2 21.98,26.17 23.02,25.13 23.02,23.2 23.88,22.35 R12.5
N$38
  Bottom 0.152: C23.2 R24.1
N$39
  Bottom 0.152: C21.2 R23.1
NFAULT
  Top 0.152: U3.24 16.39,31.02 16.39,31.35 16.55,31.5 U7.13 16.55,32.92 16.19,33.28 15.79,33.28 15.69,33.17 R9.2
NSLEEP  (via drill 0.2)
  Top 0.152: U3.25 15.89,31.02 15.89,31.45 15.99,31.55 15.99,32.55 v15.99,32.8 | v15.86,33.89 15.06,33.89 U7.12
  Bottom 0.152: v15.86,33.89 15.99,33.76 v15.99,32.8
OC_REF
  Top 0.152: U3.26 15.25,31.18 15.38,31.31 15.38,32.2 15.25,32.34 R13.1 12.97,32.5 R10.2
OPOUTB  (via drill 0.2)
  Top 0.152: v22.5,29.92 R11.1
  Bottom 0.152: U11.1 22.5,28.73 v22.5,29.92
OUT+  (via drill 0.2)
  Top 0.152: v21,19 22.15,20.15 22.15,24.92 C15.1 21.1,25.99 20.39,26.7 18.75,26.7 18.02,25.97 16.79,25.97 U3.14
  other vias: 18.5,18.5 18,19 19,19 20,19 21,18 20,18 19,18 18,18 19.5,18.5 20.5,18.5 25,14.84 26.04,14.84 18.5,17.5 20,17 19,17 18,17 19.5,17.5 20.5,17.5 28.9,15.05 24,13.84 25,13.84 26.04,13.84 24,12.84 25,12.84 26.04,12.84 24.5,14.35 25.55,14.35 25.55,13.35 24.5,13.35 23.5,13.35 26.5,14.35 26.5,13.35 18.5,19.4 19.45,19.45 20.5,19.45
  pour Route2 (no thermals): 16.18,15.13 16.16,15.11 13.03,11.97 13.03,4.08 20.77,4.08 20.77,8.47 20.79,8.49 22.46,10.16 22.48,10.18 28.72,10.18 29.92,11.38 29.92,15.42 23.28,15.42 23.26,15.44 22.29,16.41 22.27,16.43 22.27,19.97 16.18,19.97
  pour Top (no thermals): 16.18,15.13 16.16,15.11 13.03,11.97 13.03,4.08 20.77,4.08 20.77,8.47 20.79,8.49 22.46,10.16 22.48,10.18 28.72,10.18 29.92,11.38 29.92,15.42 23.28,15.42 23.26,15.44 22.29,16.41 22.27,16.43 22.27,19.97 16.18,19.97
OUT-  (via drill 0.2)
  Top 0.152: v5,14.14 5.18,14.32 5.95,14.32 9,17.37 9,24.23 C16.2 11.42,26.88 12.87,27.31 13.06,27.51 13.39,27.51 U3.6 | C23.1 2.83,13.43 v2.85,13.45 | v10.5,19.55 10.27,19.79 v9.88,19.79
  Bottom 0.152: v9.88,19.79 9.9,19.77 R30.2
  other vias: 11,19 12,19 13,19 14,19 14,18 13,18 12,18 11,18 11.5,18.5 12.5,18.5 13.5,18.5 13.5,19.55 12.5,19.55 11.5,19.55 6,13 5,13 4,13 4,12 5,12 6,12 5.5,13.5 4.5,13.55 4.5,12.55 5.5,12.55 3.5,12.55 10,19 10.5,18.5 14,17 13,17 12,17 11.5,17.5 12.5,17.5 13.5,17.5 3,11.95 3.5,13.55 4,14.18 0.86,13.43
  pour Top (no thermals): 9.36,17.06 6.94,14.64 6.92,14.62 0.08,14.62 0.08,4.08 12.67,4.08 12.67,12.07 12.69,12.09 15.82,15.23 15.82,20.02 9.38,20.02 9.38,17.08
  pour Route2 (no thermals): 9.26,16.56 7.34,14.64 7.32,14.62 0.08,14.62 0.08,4.08 12.67,4.08 12.67,12.07 12.69,12.09 15.82,15.23 15.82,19.97 9.28,19.97 9.28,16.58
PWMA  (via drill 0.2)
  Top 0.152: v22.55,36.46 23.49,36.46 U7.30 | U3.20 v18.05,29.15
  Bottom 0.152: v22.55,36.46 22.46,36.37 16.43,36.37 14.7,34.63 14.7,34.86 PWMA.TP 15.29,34.64 15.29,31.6 17.74,29.15 v18.05,29.15
PWMB  (via drill 0.2)
  Top 0.152: U3.18 v18.5,28.15 | v22.53,35.65 22.78,35.9 U7.29
  Bottom 0.152: v22.53,35.65 22.85,35.65 23.15,35.95 23.15,36.54 22.75,36.94 15.63,36.94 14.17,35.48 14.17,35 14.15,34.98 PWMB.TP 14.7,33.05 14.7,31.76 18.31,28.15 v18.5,28.15
SP
  Bottom 0.152: U11.3 21.48,26.24 22.28,25.44 22.28,23.05 21.58,22.35 R12.6
SW
  Top 0.152: L1.2 15.15,45.47 15.1,45.52 13.99,45.52 C8.1 13.17,46.25 11.92,47.5 IC2.6
SWCLK
  Top 0.152: U7.37 22.05,41.25 22.38,41.58 27.21,41.58 30.2,38.6 U$1.2
SWDIO
  Top 0.152: U7.34 23.88,38.4 24,38.28 24.24,38.28 26.36,36.16 U$1.3
TEMP  (via drill 0.2)
  Top 0.152: C27.1 18.96,30.29 R16.1 18.8,31.08 18.17,31.71 18.17,32.28 U7.16
  Route2 0.152: v16.09,20.23 21.88,20.23 22.2,20.55 22.2,26.24 19.22,29.22 19.2,29.24 19.09,29.35 C27.1
  other vias: 18.97,29.35
UART_RX  (via drill 0.2)
  Top 0.152: U7.43 19.05,40.08 v18.94,39.97
  Bottom 0.152: v18.94,39.97 18.94,40.51 12.51,46.94 U$2.3
UART_TX  (via drill 0.2)
  Top 0.152: U7.42 19.57,40.88 19.57,39.93 v19.6,39.9
  Bottom 0.152: v19.6,39.9 19.6,40.28 14.95,44.93 U$2.2
VCC  (via drill 0.2)
  Top 0.152: C20.1 28.4,20.05 23.12,20.05 22.76,20.41 22.76,25.96 R3.1 | v5,47.95 5.24,47.71 C7.1 10.49,47.72 10.99,48.22 11.32,48.22 IC2.5 IC2.4 | 8.05,49.3 8,49.24 C6.1 | U3.1 12.88,30.81 12.36,30.81 12.04,31.12 v12.04,32.46
  Route15 0.152: 7.95,36.8 7.95,30.95 10.53,30.95 v12.04,32.46
  other vias: 1,48.95 2,48.95 3,48.95 4,48.95 5,48.95 4,47.95 3,47.95 2,47.95 1,47.95 1,46.95 2,46.95 3,46.95 4,46.95 5,46.95 5,45.95 4,45.95 3,45.95 2,45.95 1,45.95 24,19 25,19 26,19 26,18 25,18 24,18 5,17 6,17 7,17 6,16 5,16 4,17 4,16 5,44.95 4,44.95 3,44.95 2,44.95 1,44.95 1.5,48.45 2.5,48.45 3.5,48.45 4.5,48.45 4.5,47.45 3.5,47.45 2.5,47.45 1.5,47.45 1.5,46.45 2.5,46.45 3.5,46.45 4.5,46.45 4.5,45.45 3.5,45.45 2.5,45.45 1.5,45.45 1.5,49.4 2.5,49.4 3.5,49.4 4.5,49.4 4,18 5,18 6,18 7,18 7,19 6,19 5,19 4,19 3,19 3.5,18.5 4.55,18.5 5.5,18.5 6.5,18.5 6.5,17.5 5.5,17.5 4.55,17.5 4.55,16.5 5.5,16.5 6.5,16.5 5.5,15.5 4.55,15.5 7.45,17.5 7.45,18.5 27,19 27,18 24.5,18.5 25.5,18.5 26.5,18.5 26,17 25,17 24,17 27,17 24.5,17.5 25.5,17.5 26.5,17.5 24.5,16.5 25.5,16.5 26.5,16.5 24.5,19.5 25.5,19.5 26.5,19.5 6.47,15.53 3.42,17.52 2.5,18.47 7.4,16.55 6.92,16.08
  pour Top (no thermals): 23.35,15.8 29.45,15.8 29.85,16.2 29.85,20.11 22.6,20.11 22.6,16.55
  pour Bottom (no thermals): 0,16 8.9,16 8.9,50 0,50
  pour Bottom (no thermals): 0,0 34,0 34,20 0,20
  pour Route15 (no thermals): 0,16 8.9,16 8.9,50 0,50
  pour Route15 (no thermals): 0,0 33.92,0 33.92,20 0,20
  pour Route2 (no thermals): 23.35,15.8 29.45,15.8 29.85,16.2 29.85,20.01 22.6,20.01 22.6,16.55
  pour Top (no thermals): 0.08,14.98 6.77,14.98 8.92,17.13 8.92,49.92 0.08,49.92
  pour Route2 (no thermals): 0.08,14.98 7.22,14.98 8.92,16.68 8.92,49.92 0.08,49.92
VCS  (via drill 0.2)
  Top 0.152: U3.17 v18.05,27.65
  Route2 0.152: 18,24.25 v18,24 18.05,24.05 v18.05,27.65
  other vias: 19,24 20,24 21,24 21,23.05 20,23.05 19,23.05 18.94,21.64 20.55,21.64 20.95,21.19 19.36,21.2 18,23 12.06,21 13,21 14,21 14,22 13,22 12,22 18.5,23.55 19.5,23.55 20.5,23.55 20.15,21.25 21.4,21.64 21.4,23.5 19.75,21.64 18.29,21.84 18.5,21.2 18.95,20.71 19.75,20.71 20.55,20.71 21.4,20.71 12.51,21.5 13.51,21.5 14.51,21.5 11.46,21.5 12.51,22.45 13.51,22.45 11.46,22.45
  pour Bottom (no thermals): 11.05,20.45 22.05,20.45 22.05,24.3 21.1,25.25 11.95,25.25 11.05,24.35
  pour Route15 (no thermals): 11.05,20.4 22.05,20.4 22.05,24.3 21.1,25.25 11.95,25.25 11.05,24.35
  pour Route2 (no thermals): 11.05,20.4 22.05,20.4 22.05,24.3 21.1,25.25 11.95,25.25 11.05,24.35
  pour Top (no thermals): 11.05,20.4 22.05,20.4 22.05,24.3 21.1,25.25 11.95,25.25 11.05,24.35
VREF  (via drill 0.2)
  Top 0.152: R6.1 24.6,29.4 R7.2
  Bottom 0.152: U11.5 20.64,28.87 20.64,29.6 21.44,30.4 R7.2
  other vias: 23.6,30.4
VREG
  Top 0.152: C14.2 13.05,28.8 13.06,28.79 13.39,28.79 U3.4
VSENSE
  Top 0.152: R3.2 22.77,27.75 C28.1 21.62,27.86 R4.1 20.44,29 20.44,30.78 19.95,31.27 19.61,31.27 19.05,31.83 U7.18
(copper drawn outside any net)
  shapes: Route15 area x1, Route2 area x1

### Text on the board
tPlace: +3V3 | CLK | DIO | GND | Mini_Shirasu | by ykc | 8A cont. / 12A peak
bPlace: +24V | GND | GND | +3V3
bNames: R | T | PWMA